# EAGLE design Pi_grammer_SPI_ISOLATE (EAGLE 7.6.0)
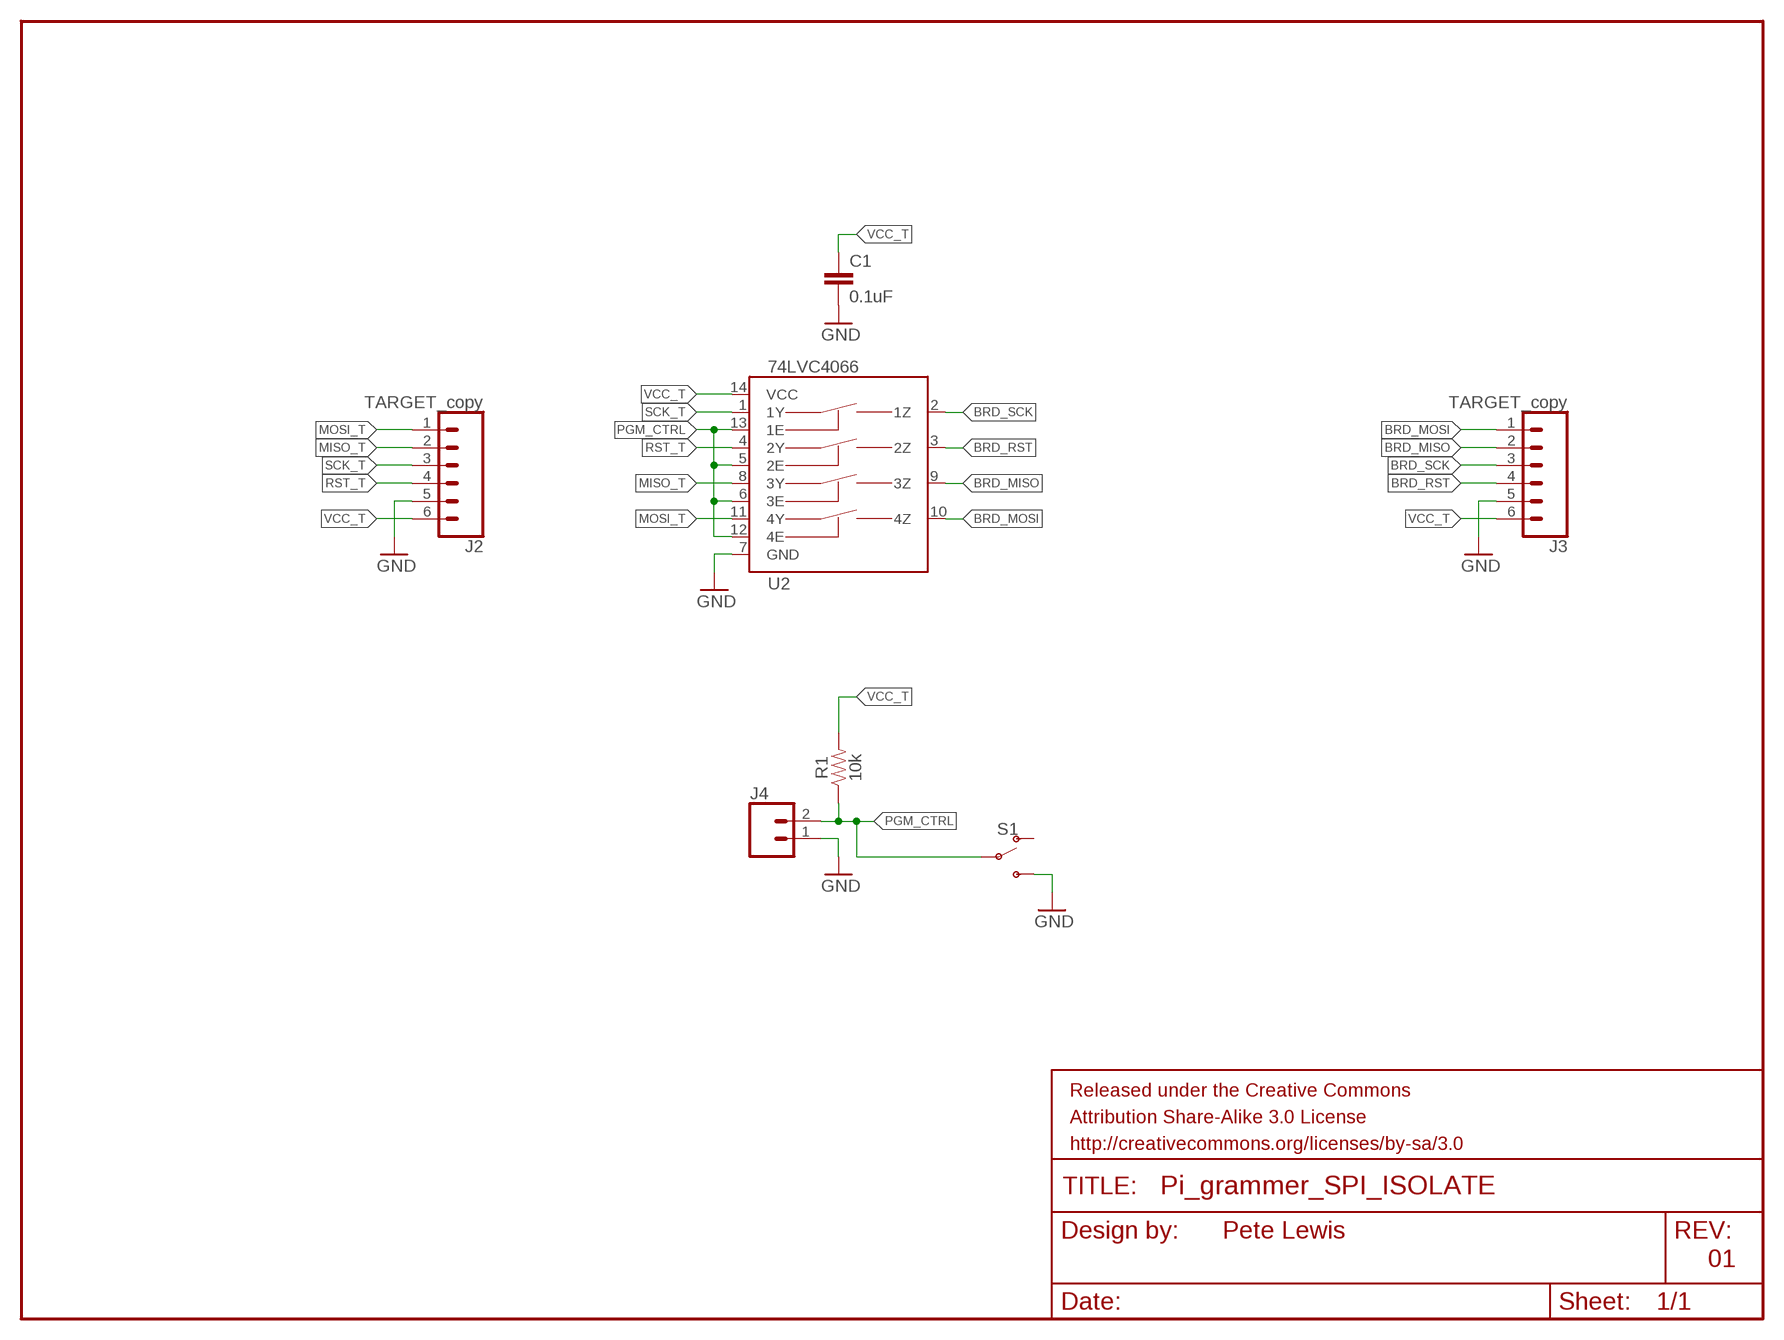
[diagram p0: schematic, sheet 1]

## Parts
C1  0.1uF  0.1UF-0603-25V-(+80/-20%)  [0603]
J2  TARGET_copy  CONN_06LOCK  [1X06_LOCK]
J3  TARGET_copy  CONN_06LOCK  [1X06_LOCK]
J4  CONN_02  [1X02]
R1  10k  10KOHM-0603-1/10W-1%  [0603]
S1  SWITCH-SPDT-PTH-11.6X4.0MM-LOCK  [SWITCH_SPDT_PTH_11.6X4.0MM_LOCK]
U2  74LVC4066  74LVC4066_MUX_1:1_X4  [SO14]

## Nets
BRD_MISO [VCC]: J3.2 U2.9(3Z)
BRD_MOSI [VCC]: J3.1 U2.10(4Z)
BRD_RST [VCC]: J3.4 U2.3(2Z)
BRD_SCK [VCC]: J3.3 U2.2(1Z)
GND: C1.2 J2.5 J3.5 J4.1 S1.3(S) U2.7(GND)
MISO_T: J2.2 U2.8(3Y)
MOSI_T: J2.1 U2.11(4Y)
PGM_CTRL: J4.2 R1.1 S1.2(P) U2.5(2E) U2.6(3E) U2.12(4E) U2.13(1E)
RST_T: J2.4 U2.4(2Y)
SCK_T: J2.3 U2.1(1Y)
VCC_T: C1.1 J2.6 J3.6 R1.2 U2.14(VCC)
Unconnected: S1.1(O)

## Notes on the sheet
- Pete Lewis
- 01

## Library data of the parts
C1 = SparkFun-Capacitors:0.1UF: 0.1µF ceramic capacitors A capacitor is a passive two-terminal electrical component used to store electrical energy temporarily in an electric field.; PROD_ID: CAP-00810
J2 J3 = SparkFun-Connectors:CONN_06: Multi connection point. Often used as Generic Header-pin footprint for 0.1 inch spaced/style header connections On any of the 0.1 inch spaced packages, you can populate with these: Break Away Headers - Straight <https://www.sparkfun.com/products/116> (PRT-00116) Break Away Male Headers - Right Angle <https://www.sparkfun.com/products/553> (PRT-00553) Female Headers <https://www.sparkfun.com/products/115> (PRT-00115) Break Away Headers - Machine Pin <https://www.sparkfun.com/products/117> (PRT-00117) Break Away Female Headers - Swiss Machine Pin <https://www.sparkfun.com/products/743> (PRT-00743) Arduino Stackable Header - 6 Pin <https://www.sparkfun.com/products/9280> (PRT-09280) For SCREWTERMINALS and SPRING TERMINALS visit here: Screw Terimnals on SparkFun.com <https://www.sparkfun.com/search/results?term=Screw+Terminals> (5mm/3.5mm/2.54mm spacing) This device is also useful as a general connection point to wire up your design to another part of your project. Our various solder wires solder well into these plated through hole pads. Hook-Up Wire - Assortment (Stranded, 22 AWG) <https://www.sparkfun.com/products/11375> (PRT-11375) Hook-Up Wire - Assortment (Solid Core, 22 AWG) <https://www.sparkfun.com/products/11367> (PRT-11367) View the entire wire category on our website here <https://www.sparkfun.com/categories/141>; PROD_ID: CONN-10140
J4 = SparkFun-Connectors:CONN_02: Multi connection point. Often used as Generic Header-pin footprint for 0.1 inch spaced/style header connections On any of the 0.1 inch spaced packages, you can populate with these: Break Away Headers - Straight <https://www.sparkfun.com/products/116> (PRT-00116) Break Away Male Headers - Right Angle <https://www.sparkfun.com/products/553> (PRT-00553) Female Headers <https://www.sparkfun.com/products/115> (PRT-00115) Break Away Headers - Machine Pin <https://www.sparkfun.com/products/117> (PRT-00117) Break Away Female Headers - Swiss Machine Pin <https://www.sparkfun.com/products/743> (PRT-00743) For SCREWTERMINALS and SPRING TERMINALS visit here: Screw Terimnals on SparkFun.com <https://www.sparkfun.com/search/results?term=Screw+Terminals> (5mm/3.5mm/2.54mm spacing) This device is also useful as a general connection point to wire up your design to another part of your project. Our various solder wires solder well into these plated through hole pads. Hook-Up Wire - Assortment (Stranded, 22 AWG) <https://www.sparkfun.com/products/11375> (PRT-11375) Hook-Up Wire - Assortment (Solid Core, 22 AWG) <https://www.sparkfun.com/products/11367> (PRT-11367) View the entire wire category on our website here <https://www.sparkfun.com/categories/141> Special notes: Molex polarized connector foot print use with: PRT-08233 with associated crimp pins and housings. 2.54_SCREWTERM for use with PRT-10571. 3.5mm Screw Terminal footprints for PRT-08084 5mm Screw Terminal footprints for use with PRT-08432
R1 = SparkFun-Resistors:10KOHM: 10kΩ resistor A resistor is a passive two-terminal electrical component that implements electrical resistance as a circuit element. Resistors act to reduce current flow, and, at the same time, act to lower voltage levels within circuits. - Wikipedia; PROD_ID: RES-00824
S1 = SparkFun-Switches:SWITCH-SPDT: Single Pole, Double Throw (SPDT) Switch Single-pole, double-throw (SPDT) switch. Variant Overview SMD-AYZ0202 Surface Mount DPDT Switch <https://www.sparkfun.com/products/597> (COM-00597) Used on e.g. LilyPad Arduino USB - ATmega32U4 Board <https://www.sparkfun.com/products/12049> PTH-11.6X4.0MM SPDT Mini Power Switch <https://www.sparkfun.com/products/102> (COM-00102) Used on e.g. SparkFun Simon Says - Through-Hole Soldering Kit <https://www.sparkfun.com/products/10547> (KIT-10547) PTH-11.6X4.0MM-KIT KIT version of SPDT Mini Power Switch - Simplifies soldering by removing tStop of switch pins - only one side can be soldered. PTH-11.6X4.0MM-LOCK LOCK version of SPDT Mini Power Switch - Offset pins hold switch in place for easier soldering. SMD-RIGHT-ANGLE Surface Mount Right Angle Switch <https://www.sparkfun.com/products/10860> (COM-10860) Used on e.g. SparkFun ESP8266 Thing <https://www.sparkfun.com/products/13231>; PROD_ID: SWCH-08261; SF_SKU: COM-00102
U2 = Testing:74LVC4066_MUX_1:1_X4

## Net classes
3 VCC: width 0.381 mm, drill 0.508 mm, clearance 0.254 mm to class 0
9 twelve_mil: width 0.305 mm, clearance 0.127 mm
10 twenty_mil: width 0.508 mm, clearance 0.127 mm

## Board
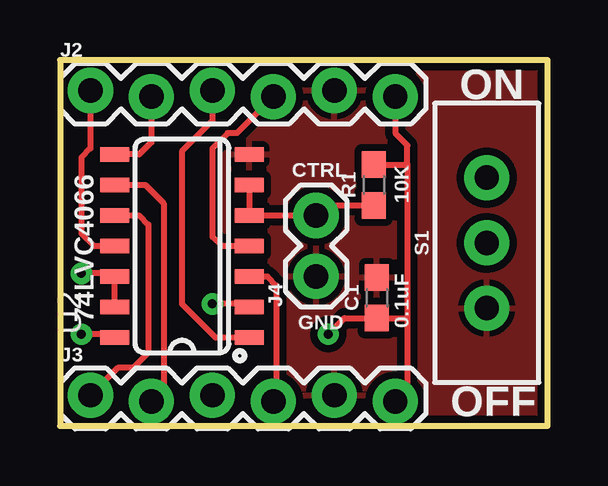
[diagram p1: board, top side]
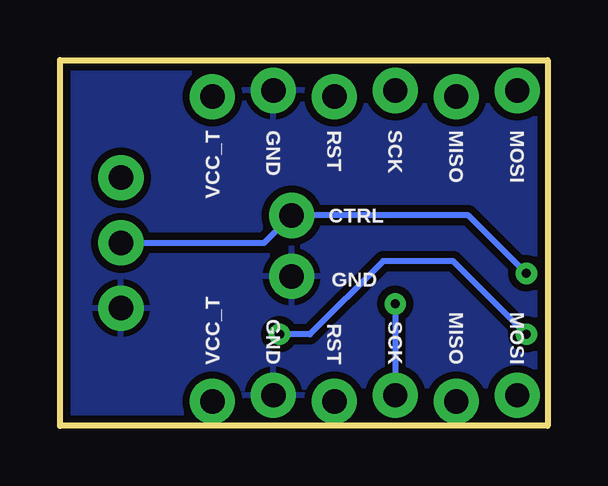
[diagram p2: board, bottom side, seen from below]

Size 20.32 x 15.24 mm. Coordinates in mm from the lower left corner, seen from the top.
Outline: 0,0 20.32,0 20.32,15.24 0,15.24 0,0
Copper layers (1*16): Top 0.035mm / dielectric 1.5mm / Bottom 0.035mm
Design rules "SparkFun-2-layer *": minimum track width 10mil, minimum drill 20mil, track to track 8mil, track to pad 8mil, pad to pad 8mil, via to via 8mil, smd to smd 8mil, copper to edge 8mil, drill to drill 8mil, minimum pad ring 12mil, minimum via ring 10mil, stop-mask expansion 4mil, vias tented up to drill 20mil, thermal gap 10mil

### Footprints (pad centres in the part's own frame; a part is rotated, then mirrored left to right if it is on the bottom)
0603 = smd 1.1 x 1: 1 -0.85,0; 2 0.85,0
1X06_LOCK = drill 1.016 pad 1.88: 1 0,0; 2 2.54,-0.254; 3 5.08,0; 4 7.62,-0.254; 5 10.16,0; 6 12.7,-0.254
1X02 = drill 1.016 pad 1.88: 1 0,0; 2 2.54,0
SWITCH_SPDT_PTH_11.6X4.0MM_LOCK = drill 1.016 pad 1.88: 1 0,2.718; 2 0,0; 3 0,-2.718
SO14 = smd 0.6 x 1.2: 1 -3.175,-2.8; 2 -1.905,-2.8; 3 -0.635,-2.8; 4 0.635,-2.8; 5 1.905,-2.8; 6 3.175,-2.8; 7 4.445,-2.8; 8 4.445,2.8; 9 3.175,2.8; 10 1.905,2.8; 11 0.635,2.8; 12 -0.635,2.8; 13 -1.905,2.8; 14 -3.175,2.8

### Placement (x,y rotation side)
C1  13.21,5.33 90 top
J2  1.27,13.97 0 top
J3  1.27,1.27 0 top
J4  10.67,6.22 90 top
R1  13.08,10.03 90 top
S1  17.78,7.62 0 top
U2  5.08,6.86 90 top

### Tracks (layer width: path | path; a pad name or v marks a point on that pad's centre or on a via)
BRD_MISO
  Top 0.254: U2.9 3.56,10.03 4.32,9.27 4.32,1.52 J3.2
BRD_MOSI
  Top 0.254: U2.10 3.3,8.76 3.68,8.38 3.68,3.05 3.05,2.41 2.41,2.41 J3.1
BRD_RST
  Top 0.254: U2.3 8.64,6.22 9.02,5.84 9.02,1.14 J3.4
BRD_SCK  (via drill 0.38)
  Top 0.254: U2.2 7.75,5.08 v6.35,5.08
  Bottom 0.254: v6.35,5.08 J3.3
GND
  pour Bottom (isolate 0.305): 20.32,15.24 0,15.24 0,0 20.32,0
  pour Top (isolate 0.305): 20.32,15.24 0,15.24 0,0 20.32,0
MISO_T
  Top 0.254: J2.2 3.81,11.81 3.3,11.3 U2.8
MOSI_T
  Top 0.254: J2.1 1.27,11.56 0.89,11.18 0.89,8 1.4,7.49 U2.11
PGM_CTRL  (via drill 0.38)
  Top 0.254: U2.6 U2.5 J4.2 11.09,9.18 R1.1 | U2.13 U2.12 2.15,6.35 v0.89,6.35
  Bottom 0.254: v0.89,6.35 3.3,8.76 J4.2 11.81,7.62 S1.2
RST_T
  Top 0.254: J2.4 7.37,12.19 6.99,12.19 6.35,11.56 6.35,7.87 6.73,7.49 U2.4
SCK_T
  Top 0.254: J2.3 6.35,12.7 5.08,11.43 5.08,5.08 6.48,3.68 U2.1
VCC_T  (via drill 0.38)
  Top 0.254: J2.6 13.97,12.19 14.48,11.68 14.48,10.88 | 14.48,10.88 14.48,4.48 | 14.48,4.48 14.48,1.52 J3.6 | 13.13,4.82 C1.1 | C1.1 14.48,4.48 | R1.2 14.48,10.88 | U2.14 2.15,3.81 v0.89,3.81 | v11.18,3.81 11.85,4.48 C1.1
  Bottom 0.254: v0.89,3.81 3.94,6.86 6.86,6.86 9.91,3.81 v11.18,3.81

### Text on the board
tPlace: ON | CTRL | 10K | GND | 0.1uF | OFF
bPlace: MOSI | MISO | SCK | RST | GND | VCC_T | CTRL | GND | MOSI | MISO | SCK | RST | GND | VCC_T